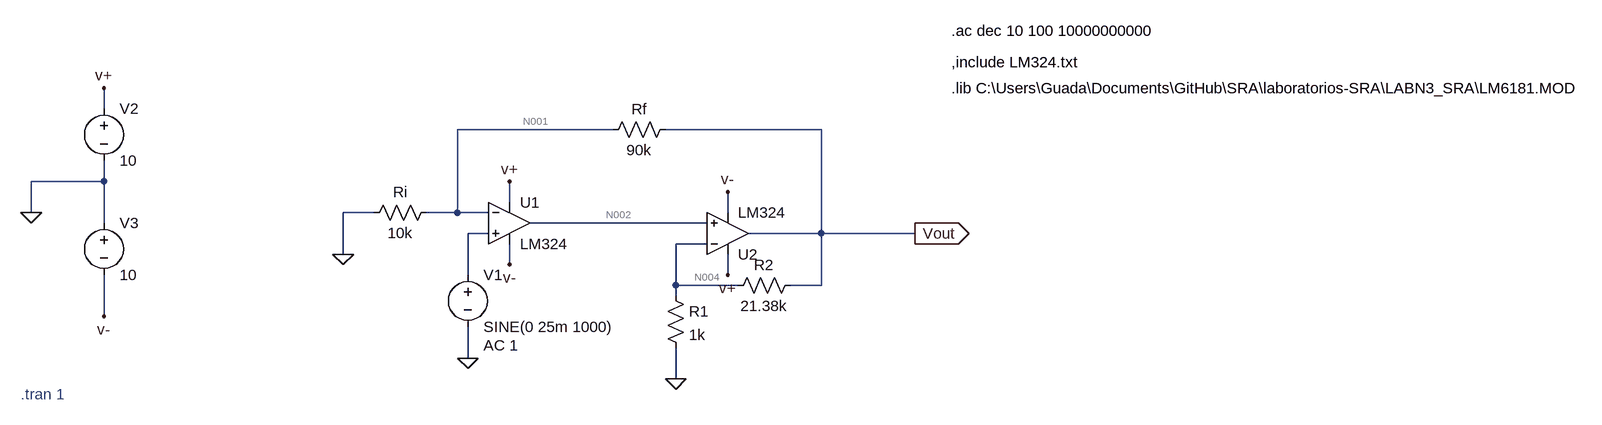
[diagram p0: schematic VFA-VFA.asc]
VFA-VFA.asc, the LTspice schematic file:
Version 4
SHEET 1 1968 680
WIRE -400 48 -400 16
WIRE 384 80 144 80
WIRE 704 80 464 80
WIRE -400 160 -400 128
WIRE -400 160 -512 160
WIRE 224 192 224 160
WIRE -512 208 -512 160
WIRE 16 208 -32 208
WIRE 144 208 144 80
WIRE 144 208 96 208
WIRE 192 208 144 208
WIRE 560 208 560 176
WIRE -400 224 -400 160
WIRE 528 224 256 224
WIRE 192 240 160 240
WIRE 704 240 704 80
WIRE 704 240 592 240
WIRE 848 240 704 240
WIRE 528 256 480 256
WIRE -32 272 -32 208
WIRE 224 288 224 256
WIRE 160 304 160 240
WIRE 560 304 560 272
WIRE 480 320 480 256
WIRE 576 320 480 320
WIRE 704 320 704 240
WIRE 704 320 656 320
WIRE 480 336 480 320
WIRE -400 368 -400 304
WIRE 160 432 160 384
WIRE 480 464 480 416
FLAG -32 272 0
FLAG 160 432 0
FLAG 480 464 0
FLAG 848 240 Vout
IOPIN 848 240 Out
FLAG -512 208 0
FLAG 224 160 v+
FLAG 560 304 v+
FLAG -400 16 v+
FLAG -400 368 v-
FLAG 224 288 v-
FLAG 560 176 v-
SYMBOL OpAmps\\opamp2 224 160 R0
SYMATTR InstName U1
SYMATTR Value LM324
SYMBOL OpAmps\\opamp2 560 304 M180
SYMATTR InstName U2
SYMATTR Value LM324
SYMBOL res 464 320 R0
SYMATTR InstName R1
SYMATTR Value 1k
SYMBOL res 672 304 R90
WINDOW 0 0 56 VBottom 2
WINDOW 3 32 56 VTop 2
SYMATTR InstName R2
SYMATTR Value 21.38k
SYMBOL res 112 192 R90
WINDOW 0 0 56 VBottom 2
WINDOW 3 32 56 VTop 2
SYMATTR InstName Ri
SYMATTR Value 10k
SYMBOL res 480 64 R90
WINDOW 0 0 56 VBottom 2
WINDOW 3 32 56 VTop 2
SYMATTR InstName Rf
SYMATTR Value 90k
SYMBOL voltage 160 288 R0
WINDOW 123 24 124 Left 2
WINDOW 39 0 0 Left 0
SYMATTR InstName V1
SYMATTR Value SINE(0 25m 1000)
SYMATTR Value2 AC 1
SYMBOL voltage -400 32 R0
SYMATTR InstName V2
SYMATTR Value 10
SYMBOL voltage -400 208 R0
SYMATTR InstName V3
SYMATTR Value 10
TEXT 904 -24 Left 2 !,include LM324.txt
TEXT 904 16 Left 2 !.lib C:\\Users\\Guada\\Documents\\GitHub\\SRA\\laboratorios-SRA\\LABN3_SRA\\LM6181.MOD
TEXT -528 488 Left 2 ;.tran 1
TEXT 904 -72 Left 2 !.ac dec 10 100 10000000000

The netlist it stands for:
* VFA-VFA.asc
XU1 N003 N001 v+ v- N002 LM324  ; pins In+ In- V+ V- OUT
XU2 N002 N004 v+ v- Vout LM324  ; pins In+ In- V+ V- OUT
R1 N004 0 1k
R2 Vout N004 21.38k
Ri N001 0 10k
Rf Vout N001 90k
V1 N003 0 SINE(0 25m 1000) AC 1
V2 v+ 0 10
V3 0 v- 10
,include LM324.txt
.lib C:\Users\Guada\Documents\GitHub\SRA\laboratorios-SRA\LABN3_SRA\LM6181.MOD
* .tran 1
.ac dec 10 100 10000000000
.backanno
.end

* Results of the author's LTspice run, read from the files saved beside the schematic
* Operating Point, zero values left out:
*   V(n002) = -42.54 µV
*   V(v-) = -10 V
*   V(v+) = 10 V
*   V(n001) = -33.66 µV
*   V(vout) = -2.131 mV
*   V(n004) = -76.17 µV
*   I(R1) = -76.17 nA
*   I(R2) = -96.11 nA
*   I(Ri) = -3.366 nA
*   I(Rf) = -23.3 nA
*   I(V1) = 19.92 nA
*   I(V2) = -1.34 mA
*   I(V3) = -1.34 mA
*   Ix(u1:1) = -19.92 nA
*   Ix(u1:2) = -19.94 nA
*   Ix(u1:3) = 669.9 µA
*   Ix(u1:4) = -669.8 µA
*   Ix(u1:5) = 19.92 nA
*   Ix(u2:1) = -19.92 nA
*   Ix(u2:2) = -19.94 nA
*   Ix(u2:3) = 669.9 µA
*   Ix(u2:4) = -669.8 µA
*   Ix(u2:5) = 119.4 nA
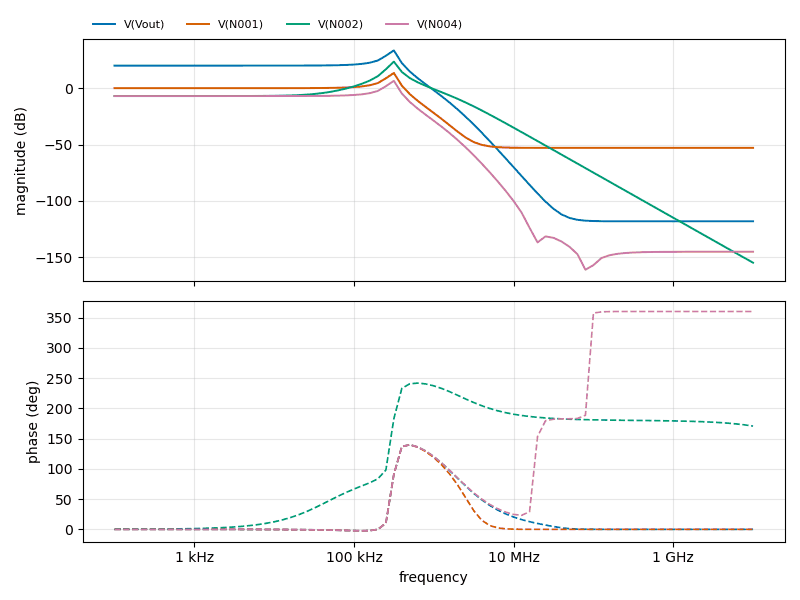
[diagram p1: AC Analysis of VFA-VFA.asc, plotted from the saved traces]
* AC Analysis, 1 run:
*   V(Vout): 20.00 dB at 100 Hz, -118.08 dB at 10 GHz, peak 33.48 dB at 316.2 kHz, 3 dB below the peak at 273.3 kHz and 336.4 kHz
*   V(N001): -0.00 dB at 100 Hz, -52.95 dB at 10 GHz, peak 13.46 dB at 316.2 kHz, 3 dB below the peak at 273.2 kHz and 336.4 kHz
*   V(N002): -7.00 dB at 100 Hz, -154.81 dB at 10 GHz, peak 23.53 dB at 316.2 kHz, 3 dB below the peak at 285.4 kHz and 341.1 kHz
*   V(N004): -7.00 dB at 100 Hz, -145.08 dB at 10 GHz, peak 6.48 dB at 316.2 kHz, 3 dB below the peak at 273.3 kHz and 336.4 kHz